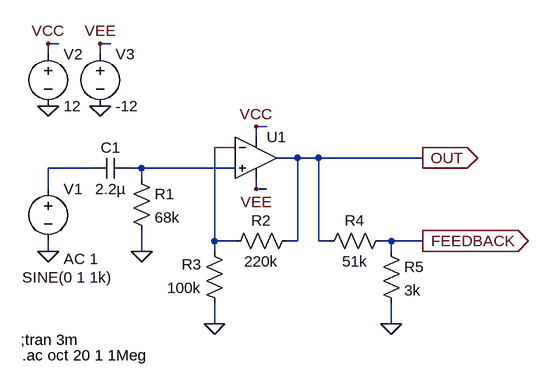
[diagram p0: schematic 3320_Output.asc]
3320_Output.asc, the LTspice schematic file:
Version 4
SHEET 1 880 680
WIRE -32 -32 -48 -32
WIRE 48 -32 32 -32
WIRE -48 -16 -48 -32
WIRE 32 -16 32 -32
WIRE 288 96 272 96
WIRE 272 112 272 96
WIRE 240 128 208 128
WIRE 336 144 304 144
WIRE 368 144 336 144
WIRE 528 144 368 144
WIRE 16 160 -48 160
WIRE 96 160 80 160
WIRE 240 160 96 160
WIRE 96 176 96 160
WIRE -48 192 -48 160
WIRE 272 192 272 176
WIRE 288 192 272 192
WIRE 208 272 208 128
WIRE 240 272 208 272
WIRE 336 272 336 144
WIRE 336 272 320 272
WIRE 368 272 368 144
WIRE 384 272 368 272
WIRE 480 272 464 272
WIRE 528 272 480 272
WIRE -48 288 -48 272
WIRE 96 288 96 256
WIRE 208 288 208 272
WIRE 480 288 480 272
WIRE 208 400 208 368
WIRE 480 400 480 368
FLAG 272 96 VCC
FLAG 272 192 VEE
FLAG -48 288 0
FLAG 528 144 OUT
IOPIN 528 144 Out
FLAG 96 288 0
FLAG 208 400 0
FLAG 480 400 0
FLAG 528 272 FEEDBACK
IOPIN 528 272 Out
FLAG -48 64 0
FLAG 32 64 0
FLAG -48 -32 VCC
FLAG 32 -32 VEE
SYMBOL Opamps\\UniversalOpamp2 272 144 R0
SYMATTR InstName U1
SYMBOL cap 80 144 R90
WINDOW 0 0 32 VBottom 2
WINDOW 3 32 32 VTop 2
SYMATTR InstName C1
SYMATTR Value 2.2µ
SYMBOL res 80 160 R0
SYMATTR InstName R1
SYMATTR Value 68k
SYMBOL res 336 256 R90
WINDOW 0 0 56 VBottom 2
WINDOW 3 32 56 VTop 2
SYMATTR InstName R2
SYMATTR Value 220k
SYMBOL res 224 384 R180
WINDOW 0 36 76 Left 2
WINDOW 3 36 40 Left 2
SYMATTR InstName R3
SYMATTR Value 100k
SYMBOL voltage -48 176 R0
WINDOW 3 -40 152 Left 2
WINDOW 123 24 124 Left 2
WINDOW 39 0 0 Left 0
SYMATTR InstName V1
SYMATTR Value SINE(0 1 1k)
SYMATTR Value2 AC 1
SYMBOL res 480 256 R90
WINDOW 0 0 56 VBottom 2
WINDOW 3 32 56 VTop 2
SYMATTR InstName R4
SYMATTR Value 51k
SYMBOL res 464 272 R0
SYMATTR InstName R5
SYMATTR Value 3k
SYMBOL voltage -48 -32 R0
WINDOW 123 0 0 Left 0
WINDOW 39 0 0 Left 0
SYMATTR InstName V2
SYMATTR Value 12
SYMBOL voltage 32 -32 R0
WINDOW 123 0 0 Left 0
WINDOW 39 0 0 Left 0
SYMATTR InstName V3
SYMATTR Value -12
TEXT -90 424 Left 2 !;tran 3m
TEXT -88 448 Left 2 !.ac oct 20 1 1Meg

The netlist it stands for:
* 3320_Output.asc
XU1 N003 N001 VCC VEE OUT level.2 Avol=1Meg GBW=10Meg Slew=10Meg ilimit=25m rail=0 Vos=0 phimargin=45 en=0 enk=0 in=0 ink=0 Rin=500Meg  ; pins IN+ IN- V+ V- OUT
C1 N003 N002 2.2µ
R1 N003 0 68k
R2 OUT N001 220k
R3 0 N001 100k
V1 N002 0 SINE(0 1 1k) AC 1
R4 FEEDBACK OUT 51k
R5 FEEDBACK 0 3k
V2 VCC 0 12
V3 VEE 0 -12
;tran 3m
.ac oct 20 1 1Meg
.lib UniversalOpamps2.sub
.backanno
.end